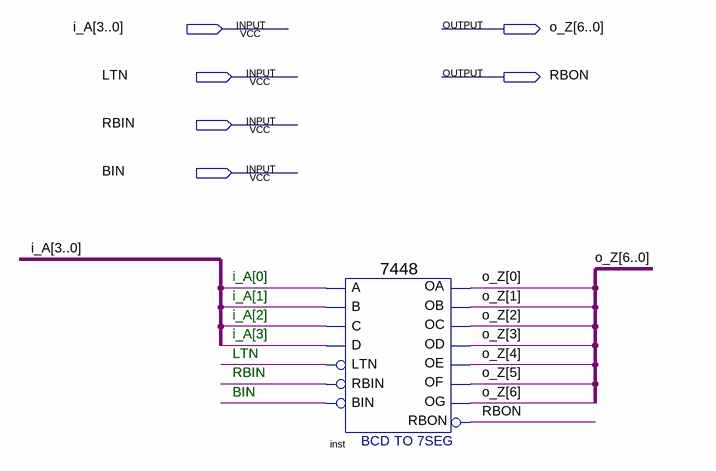
[diagram p0: schematic sheet]
// Quartus schematic ttl7448.bdf as structural Verilog: 1 symbols, 6 pins
module ttl7448 (
  input  [3:0] i_A,
  input  LTN,
  input  RBIN,
  input  BIN,
  output [6:0] o_Z,
  output RBON
);

  \7448  inst (
    .A(i_A[0]), .C(i_A[2]), .D(i_A[3]), .B(i_A[1]), .RBIN(RBIN), .BIN(BIN), .LTN(LTN), .OC(o_Z[2]),
    .OE(o_Z[4]), .OD(o_Z[3]), .OF(o_Z[5]), .OG(o_Z[6]), .OB(o_Z[1]), .OA(o_Z[0]), .RBON(RBON));

  // Notes on the sheet:
  //   i_A[0]
  //   i_A[1]
  //   i_A[2]
  //   i_A[3]
  //   LTN
  //   RBIN
  //   BIN
endmodule
